# Altium schematic sheet 接口.SchDoc
size A4; SheetNumber: 6; SheetTotal: 7
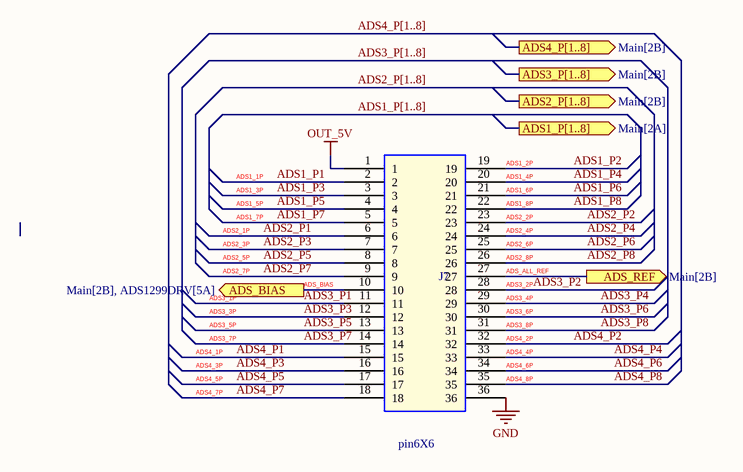
[diagram p0: 接口.SchDoc]

## Parts
J7  pin6X6  [SMD6X6]

## Ports
ADS1_P[1..8] (out, see Main[2A]), ADS2_P[1..8] (out, see Main[2B]), ADS3_P[1..8] (out, see Main[2B]), ADS4_P[1..8] (out, see Main[2B]), ADS_BIAS (out, see Main[2B], ADS1299DRV[5A]), ADS_REF (out, see Main[2B])

## Nets
GND: J7.36
OUT_5V: J7.1
ADS1_1P: J7.2  [also labelled ADS1_P1]
ADS1_2P: J7.19  [also labelled ADS1_P2]
ADS1_3P: J7.3  [also labelled ADS1_P3]
ADS1_4P: J7.20  [also labelled ADS1_P4]
ADS1_5P: J7.4  [also labelled ADS1_P5]
ADS1_6P: J7.21  [also labelled ADS1_P6]
ADS1_7P: J7.5  [also labelled ADS1_P7]
ADS1_8P: J7.22  [also labelled ADS1_P8]
ADS2_1P: J7.6  [also labelled ADS2_P1]
ADS2_2P: J7.23  [also labelled ADS2_P2]
ADS2_3P: J7.7  [also labelled ADS2_P3]
ADS2_4P: J7.24  [also labelled ADS2_P4]
ADS2_5P: J7.8  [also labelled ADS2_P5]
ADS2_6P: J7.25  [also labelled ADS2_P6]
ADS2_7P: J7.9  [also labelled ADS2_P7]
ADS2_8P: J7.26  [also labelled ADS2_P8]
ADS3_1P: J7.11  [also labelled ADS3_P1]
ADS3_2P: J7.28  [also labelled ADS3_P2]
ADS3_3P: J7.12  [also labelled ADS3_P3]
ADS3_4P: J7.29  [also labelled ADS3_P4]
ADS3_5P: J7.13  [also labelled ADS3_P5]
ADS3_6P: J7.30  [also labelled ADS3_P6]
ADS3_7P: J7.14  [also labelled ADS3_P7]
ADS3_8P: J7.31  [also labelled ADS3_P8]
ADS4_1P: J7.15  [also labelled ADS4_P1]
ADS4_2P: J7.32  [also labelled ADS4_P2]
ADS4_3P: J7.16  [also labelled ADS4_P3]
ADS4_4P: J7.33  [also labelled ADS4_P4]
ADS4_5P: J7.17  [also labelled ADS4_P5]
ADS4_6P: J7.34  [also labelled ADS4_P6]
ADS4_7P: J7.18  [also labelled ADS4_P7]
ADS4_8P: J7.35  [also labelled ADS4_P8]
ADS_ALL_REF: J7.27 ; port ADS_REF
ADS_BIAS: J7.10 ; port ADS_BIAS

## Buses and harness runs
bus ADS1_P[1..8] = port ADS1_P[1..8]
bus ADS2_P[1..8] = port ADS2_P[1..8]
bus ADS3_P[1..8] = port ADS3_P[1..8]
bus ADS4_P[1..8] = port ADS4_P[1..8]

## Library data of the parts
J7 = PIN6X6: PCB Footprint: pin6X6